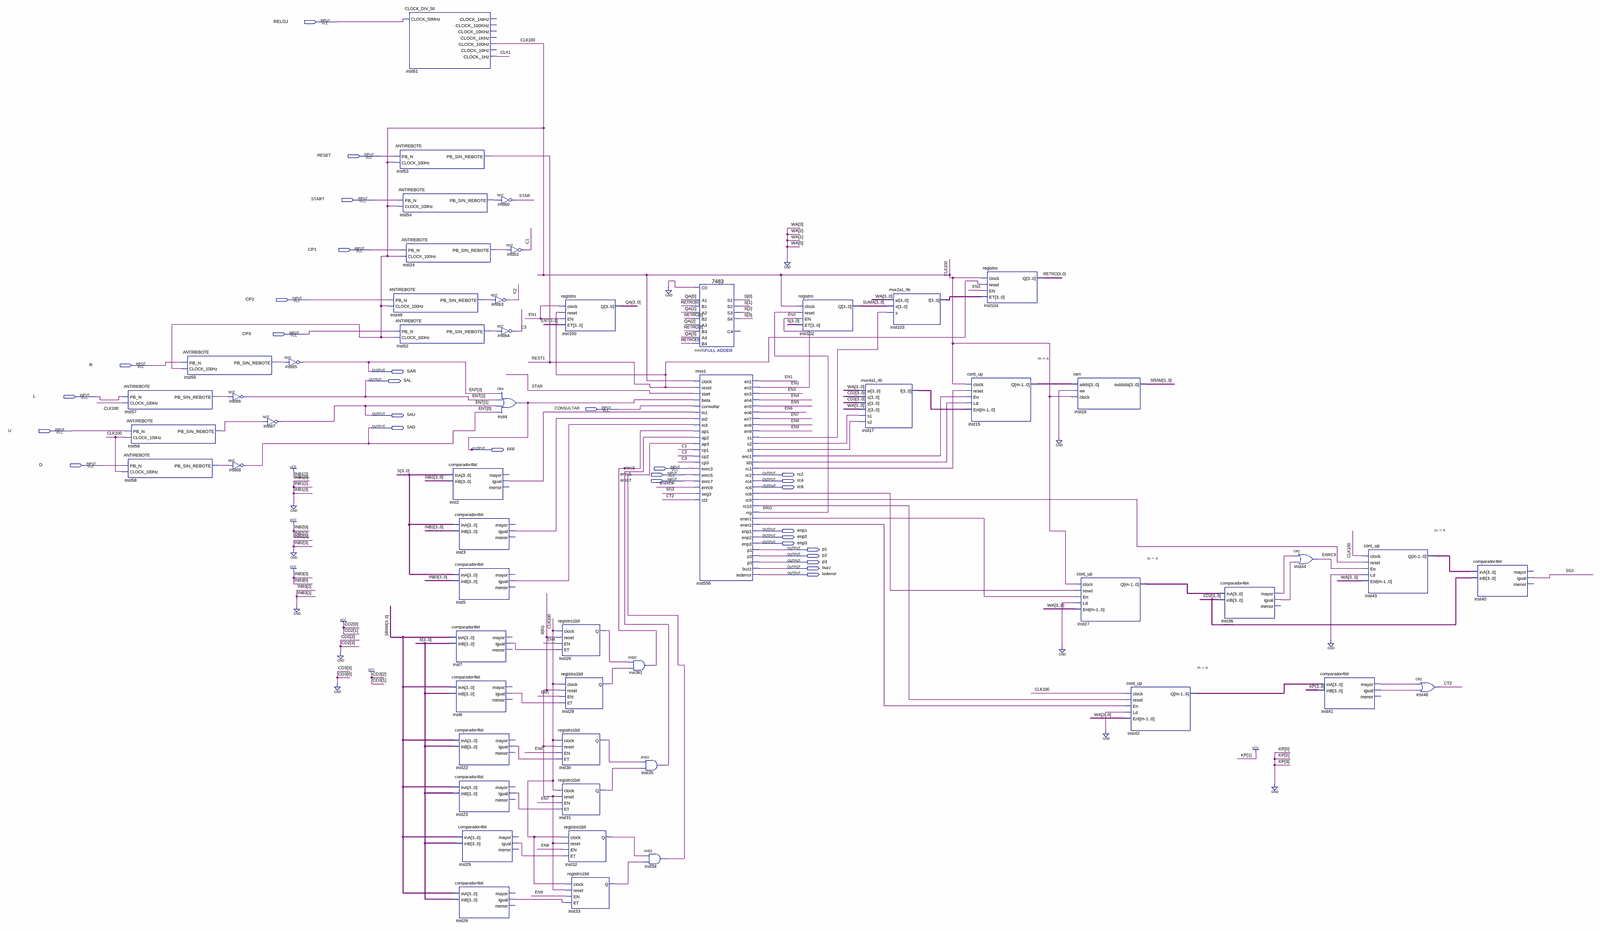
[diagram p0: schematic sheet, whole]
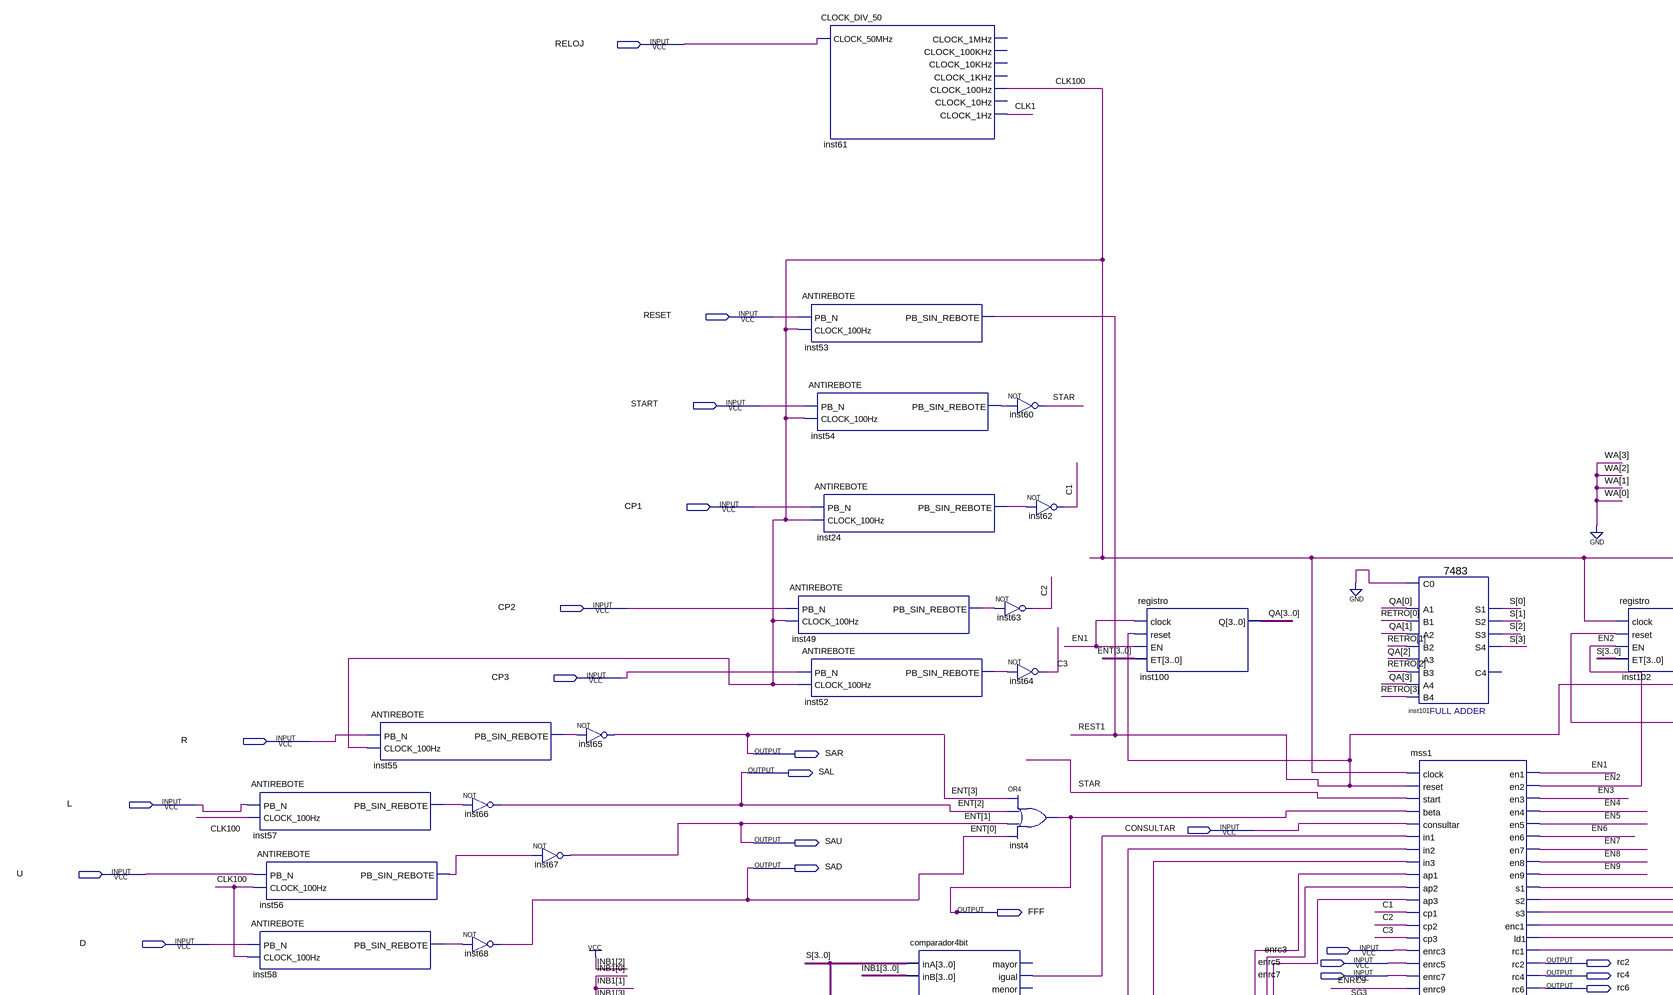
[diagram p1: schematic sheet, upper left part]
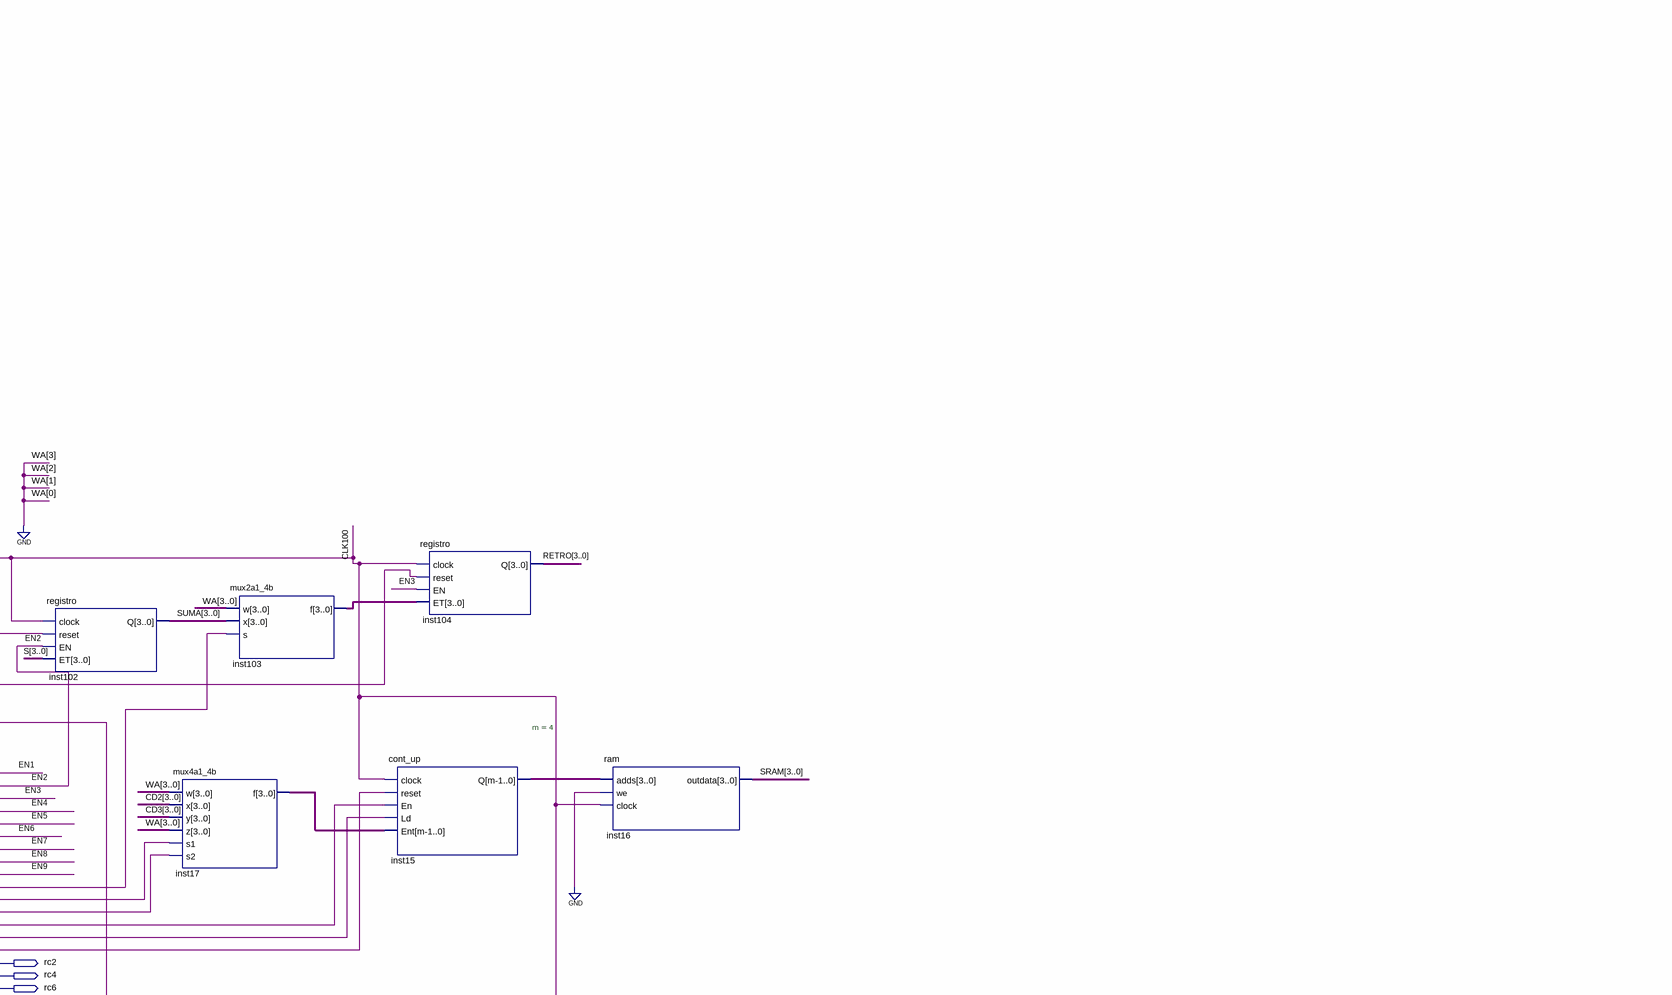
[diagram p2: schematic sheet, upper right part]
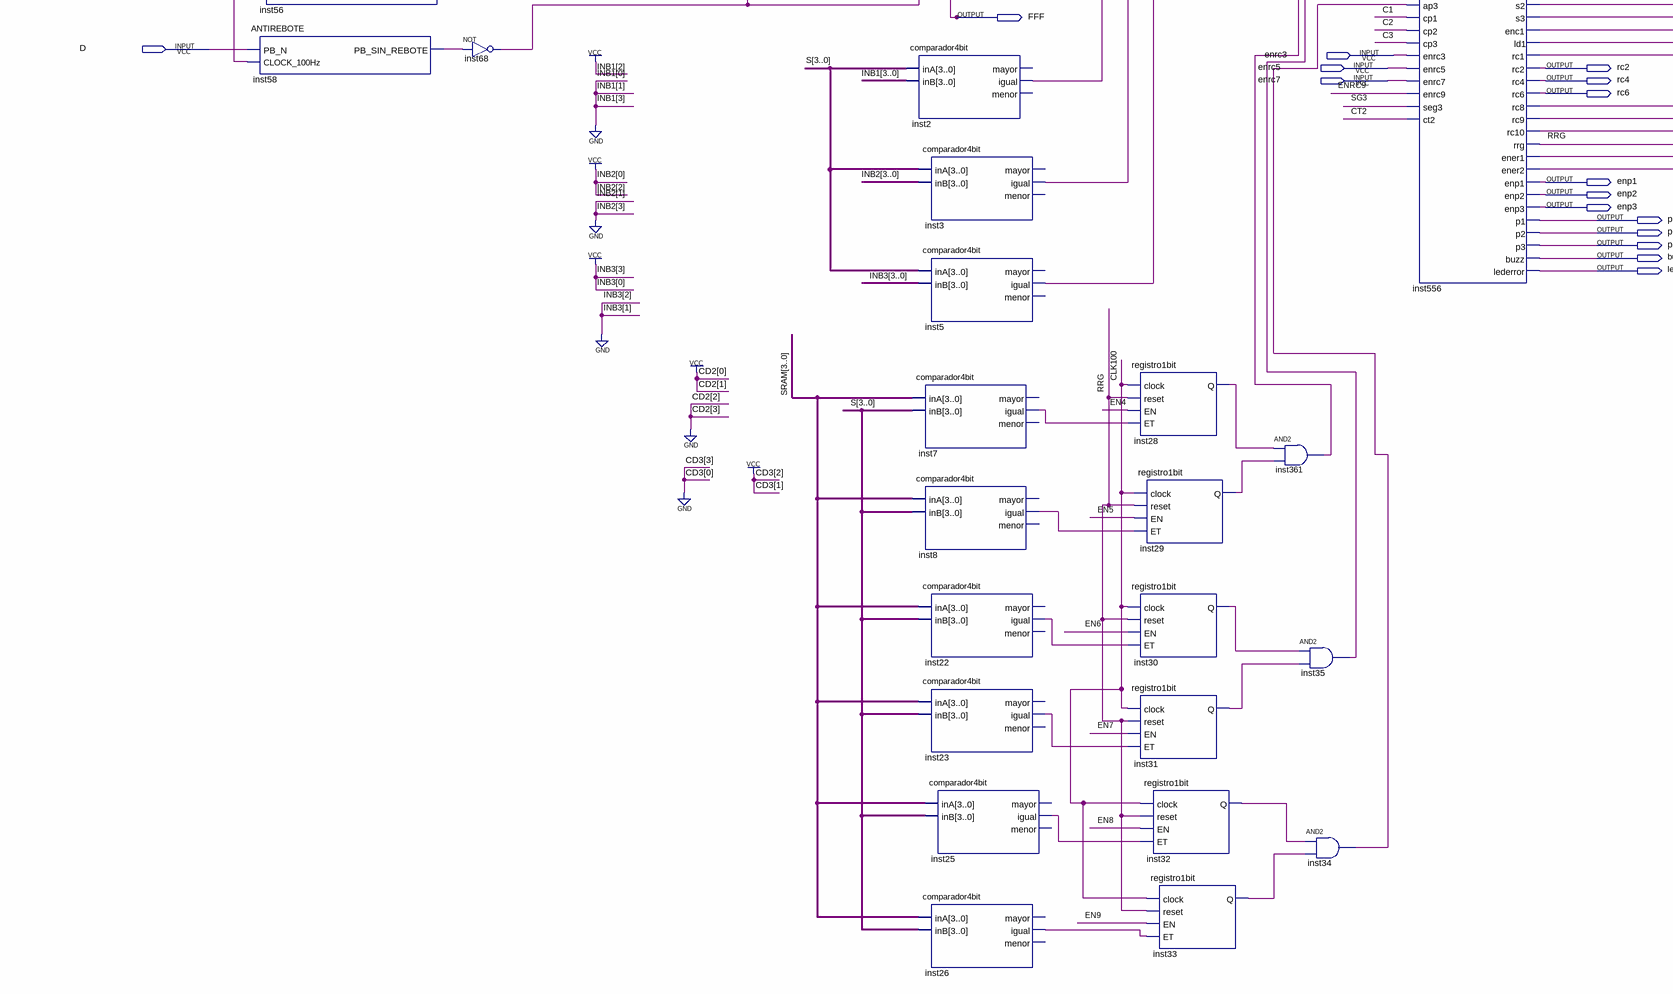
[diagram p3: schematic sheet, lower left part]
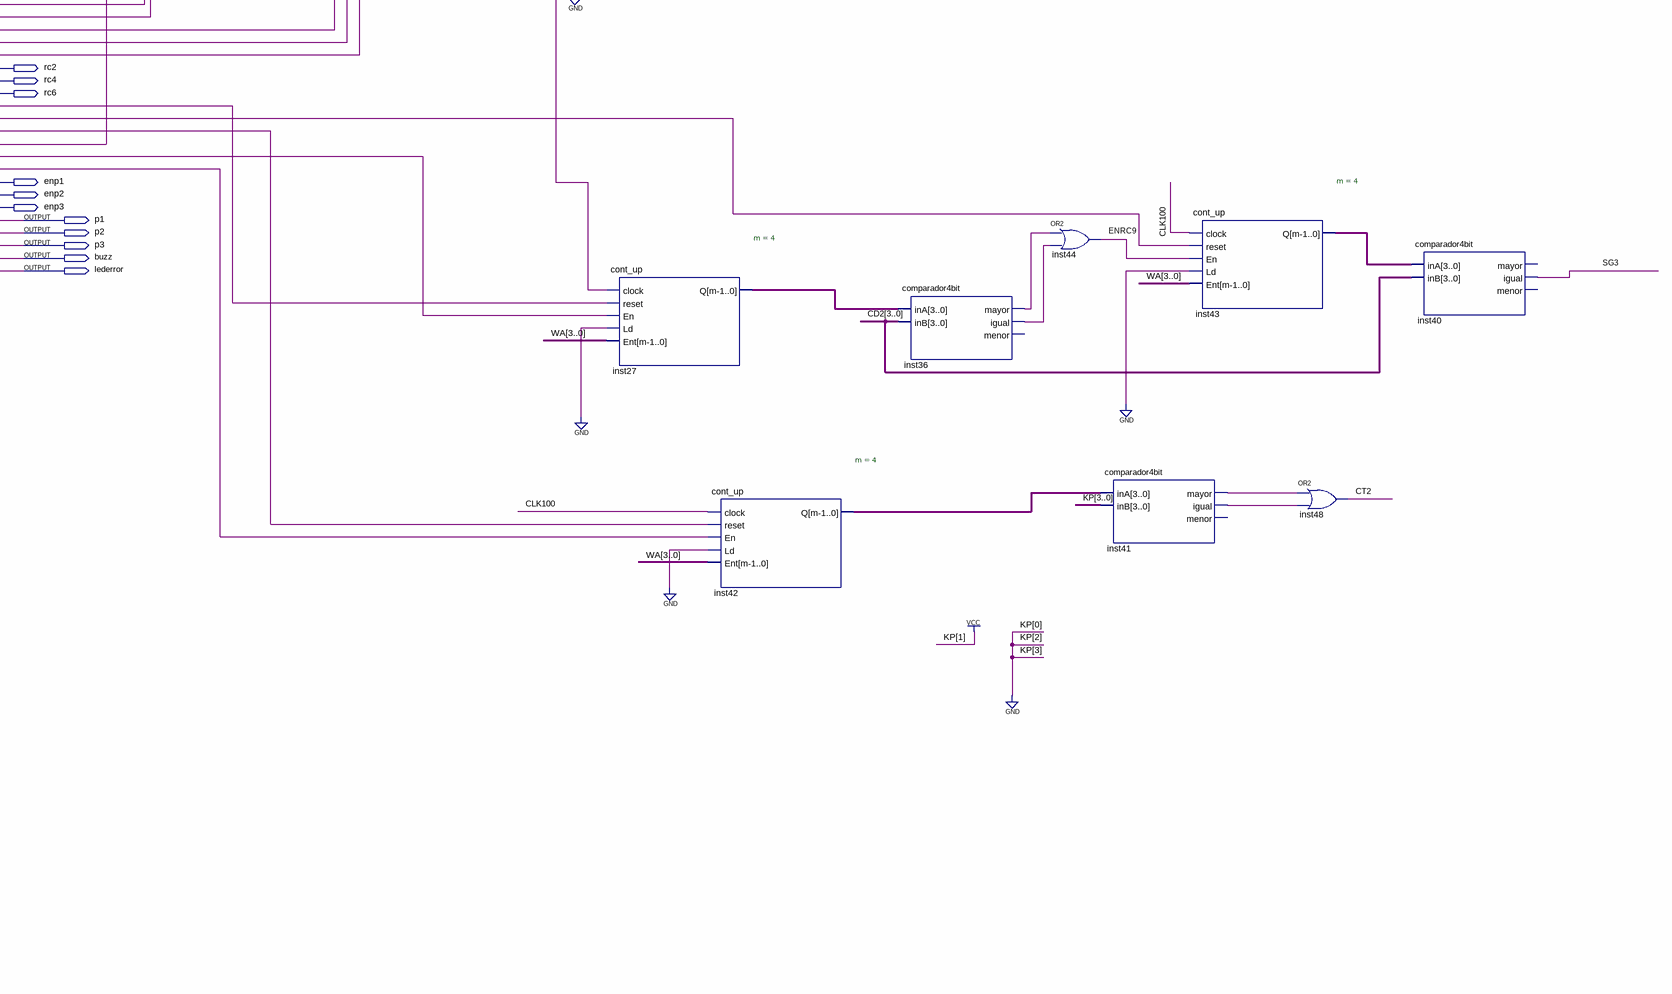
[diagram p4: schematic sheet, lower right part]
// Quartus schematic PRUEB.bdf as structural Verilog: 54 symbols, 30 pins
module PRUEB (
  input  RELOJ,
  input  RESET,
  input  START,
  input  CP1,
  input  CP2,
  input  CP3,
  input  R,
  input  L,
  input  CONSULTAR,
  input  U,
  input  D,
  input  enrc3,
  input  enrc5,
  input  enrc7,
  output SAR,
  output SAL,
  output SAU,
  output SAD,
  output FFF,
  output rc2,
  output rc4,
  output rc6,
  output enp1,
  output enp2,
  output enp3,
  output p1,
  output p2,
  output p3,
  output buzz,
  output lederror
);

  wire C1, C2, C3, CLK1, CLK100, CT2, EN1, EN2, EN3, EN4, EN5, EN6, EN7, EN8, EN9, ENRC9, inst2_igual,
       inst3_igual, inst5_igual, inst7_igual, inst8_igual, inst22_igual, inst23_igual, inst24_pb_sin_rebote,
       inst25_igual, inst26_igual, inst28_q, inst29_q, inst30_q, inst31_q, inst32_q, inst33_q, inst34_out,
       inst35_out, inst36_igual, inst36_mayor, inst41_igual, inst41_mayor, inst49_pb_sin_rebote,
       inst52_pb_sin_rebote, inst54_pb_sin_rebote, inst55_pb_sin_rebote, inst56_pb_sin_rebote,
       inst57_pb_sin_rebote, inst58_pb_sin_rebote, inst361_out, inst556_enc1, inst556_ener1, inst556_ener2,
       inst556_ld1, inst556_rc1, inst556_rc8, inst556_rc9, inst556_rc10, inst556_s1, inst556_s2, inst556_s3,
       REST1, RRG, SG3, STAR;
  wire [3:0] inst15_q, inst17_f, inst27_q, inst42_q, inst43_q, inst103_f, QA, RETRO, S, SRAM, SUMA;

  ANTIREBOTE inst57 (.PB_N(L), .CLOCK_100Hz(CLK100), .PB_SIN_REBOTE(inst57_pb_sin_rebote));
  ANTIREBOTE inst56 (.PB_N(U), .CLOCK_100Hz(CLK100), .PB_SIN_REBOTE(inst56_pb_sin_rebote));
  ANTIREBOTE inst58 (.PB_N(D), .CLOCK_100Hz(CLK100), .PB_SIN_REBOTE(inst58_pb_sin_rebote));
  ANTIREBOTE inst55 (.PB_N(R), .CLOCK_100Hz(CLK100), .PB_SIN_REBOTE(inst55_pb_sin_rebote));
  not inst66 (SAL, inst57_pb_sin_rebote);
  not inst68 (SAD, inst58_pb_sin_rebote);
  not inst67 (SAU, inst56_pb_sin_rebote);
  not inst65 (SAR, inst55_pb_sin_rebote);
  CLOCK_DIV_50 inst61 (
    .CLOCK_50MHz(RELOJ), .CLOCK_100Hz(CLK100), .CLOCK_1Hz(CLK1));  // open: CLOCK_1MHz, CLOCK_100KHz, CLOCK_10KHz, CLOCK_1KHz, CLOCK_10Hz
  ANTIREBOTE inst53 (.PB_N(RESET), .CLOCK_100Hz(CLK100), .PB_SIN_REBOTE(REST1));
  ANTIREBOTE inst54 (.PB_N(START), .CLOCK_100Hz(CLK100), .PB_SIN_REBOTE(inst54_pb_sin_rebote));
  ANTIREBOTE inst24 (.PB_N(CP1), .CLOCK_100Hz(CLK100), .PB_SIN_REBOTE(inst24_pb_sin_rebote));
  ANTIREBOTE inst49 (.PB_N(CP2), .CLOCK_100Hz(CLK100), .PB_SIN_REBOTE(inst49_pb_sin_rebote));
  ANTIREBOTE inst52 (.PB_N(CP3), .CLOCK_100Hz(CLK100), .PB_SIN_REBOTE(inst52_pb_sin_rebote));
  comparador4bit inst2 (.inA(S), .inB(4'b0100), .igual(inst2_igual));  // open: mayor, menor
  comparador4bit inst3 (.inA(S), .inB(4'b0101), .igual(inst3_igual));  // open: mayor, menor
  comparador4bit inst5 (.inA(S), .inB(4'b1001), .igual(inst5_igual));  // open: mayor, menor
  comparador4bit inst7 (.inA(SRAM), .inB(S), .igual(inst7_igual));  // open: mayor, menor
  comparador4bit inst8 (.inA(SRAM), .inB(S), .igual(inst8_igual));  // open: mayor, menor
  comparador4bit inst22 (.inA(SRAM), .inB(S), .igual(inst22_igual));  // open: mayor, menor
  comparador4bit inst23 (.inA(SRAM), .inB(S), .igual(inst23_igual));  // open: mayor, menor
  comparador4bit inst25 (.inA(SRAM), .inB(S), .igual(inst25_igual));  // open: mayor, menor
  comparador4bit inst26 (.inA(SRAM), .inB(S), .igual(inst26_igual));  // open: mayor, menor
  not inst60 (STAR, inst54_pb_sin_rebote);
  not inst62 (C1, inst24_pb_sin_rebote);
  not inst63 (C2, inst49_pb_sin_rebote);
  not inst64 (C3, inst52_pb_sin_rebote);
  or inst4 (FFF, SAR, SAL, SAU, SAD);
  registro1bit inst28 (.clock(CLK100), .reset(RRG), .EN(EN4), .ET(inst7_igual), .Q(inst28_q));
  registro1bit inst30 (.clock(CLK100), .reset(RRG), .EN(EN6), .ET(inst22_igual), .Q(inst30_q));
  registro1bit inst31 (.clock(CLK100), .reset(RRG), .EN(EN7), .ET(inst23_igual), .Q(inst31_q));
  registro inst100 (.clock(EN1), .reset(REST1), .EN(EN1), .ET({SAR, SAL, SAU, SAD}), .Q(QA));
  registro1bit inst29 (.clock(CLK100), .reset(RRG), .EN(EN5), .ET(inst8_igual), .Q(inst29_q));
  registro1bit inst32 (.clock(CLK100), .reset(RRG), .EN(EN8), .ET(inst25_igual), .Q(inst32_q));
  registro1bit inst33 (.clock(CLK100), .reset(RRG), .EN(EN9), .ET(inst26_igual), .Q(inst33_q));
  and inst361 (inst361_out, inst28_q, inst29_q);
  and inst35 (inst35_out, inst30_q, inst31_q);
  and inst34 (inst34_out, inst32_q, inst33_q);
  \7483  inst101 (
    .B4(RETRO[3]), .C0(1'b0), .A1(QA[0]), .A2(QA[1]), .B1(RETRO[0]), .B2(RETRO[1]), .A3(QA[2]),
    .B3(RETRO[2]), .A4(QA[3]), .S3(S[2]), .S4(S[3]), .S2(S[1]), .S1(S[0]));  // open: C4
  mss1 inst556 (
    .clock(CLK100), .reset(REST1), .start(STAR), .beta(FFF), .consultar(CONSULTAR), .in1(inst2_igual),
    .in2(inst3_igual), .in3(inst5_igual), .ap1(inst361_out), .ap2(inst35_out), .ap3(inst34_out), .cp1(C1),
    .cp2(C2), .cp3(C3), .enrc3(enrc3), .enrc5(enrc5), .enrc7(enrc7), .enrc9(ENRC9), .seg3(SG3), .ct2(CT2),
    .en1(EN1), .en2(EN2), .en3(EN3), .en4(EN4), .en5(EN5), .en6(EN6), .en7(EN7), .en8(EN8), .en9(EN9),
    .s1(inst556_s1), .s2(inst556_s2), .s3(inst556_s3), .enc1(inst556_enc1), .ld1(inst556_ld1),
    .rc1(inst556_rc1), .rc2(rc2), .rc4(rc4), .rc6(rc6), .rc8(inst556_rc8), .rc9(inst556_rc9),
    .rc10(inst556_rc10), .rrg(RRG), .ener1(inst556_ener1), .ener2(inst556_ener2), .enp1(enp1), .enp2(enp2),
    .enp3(enp3), .p1(p1), .p2(p2), .p3(p3), .buzz(buzz), .lederror(lederror));
  registro inst102 (.clock(CLK100), .reset(RRG), .EN(EN2), .ET(S), .Q(SUMA));
  mux4a1_4b inst17 (.w(4'b0000), .x(4'b0011), .y(4'b0110), .z(4'b0000), .s1(inst556_s2), .s2(inst556_s3), .f(inst17_f));
  mux2a1_4b inst103 (.w(4'b0000), .x(SUMA), .s(inst556_s1), .f(inst103_f));
  registro inst104 (.clock(CLK100), .reset(REST1), .EN(EN3), .ET(inst103_f), .Q(RETRO));
  cont_up #(.m(4)) inst15 (
    .clock(CLK100), .reset(inst556_rc1), .En(inst556_enc1), .Ld(inst556_ld1), .Ent(inst17_f), .Q(inst15_q));
  ram inst16 (.adds(inst15_q), .we(1'b0), .clock(CLK100), .outdata(SRAM));
  cont_up #(.m(4)) inst27 (
    .clock(CLK100), .reset(inst556_rc8), .En(inst556_ener1), .Ld(1'b0), .Ent(4'b0000), .Q(inst27_q));
  cont_up #(.m(4)) inst42 (
    .clock(CLK100), .reset(inst556_rc10), .En(inst556_ener2), .Ld(1'b0), .Ent(4'b0000), .Q(inst42_q));
  comparador4bit inst36 (.inA(inst27_q), .inB(4'b0011), .mayor(inst36_mayor), .igual(inst36_igual));  // open: menor
  or inst44 (ENRC9, inst36_mayor, inst36_igual);
  comparador4bit inst41 (.inA(inst42_q), .inB(4'b0010), .mayor(inst41_mayor), .igual(inst41_igual));  // open: menor
  cont_up #(.m(4)) inst43 (.clock(CLK100), .reset(inst556_rc9), .En(ENRC9), .Ld(1'b0), .Ent(4'b0000), .Q(inst43_q));
  or inst48 (CT2, inst41_mayor, inst41_igual);
  comparador4bit inst40 (.inA(inst43_q), .inB(4'b0011), .igual(SG3));  // open: mayor, menor

  // Other names for the same wires on the sheet: ENT[3:0] = {SAR, SAL, SAU, SAD}
endmodule
